# Altium schematic sheet 1-BLOCK DIAGRAM.SchDoc
size 420 x 297 mm; CompanyName: Microchip Technology Inc.; Organization: Microchip Technology; Address1: 2355 West Chandler Blvd.; Address2: Chandler, AZ  85224; Address4: USA; SheetTitle: **; Time: Time
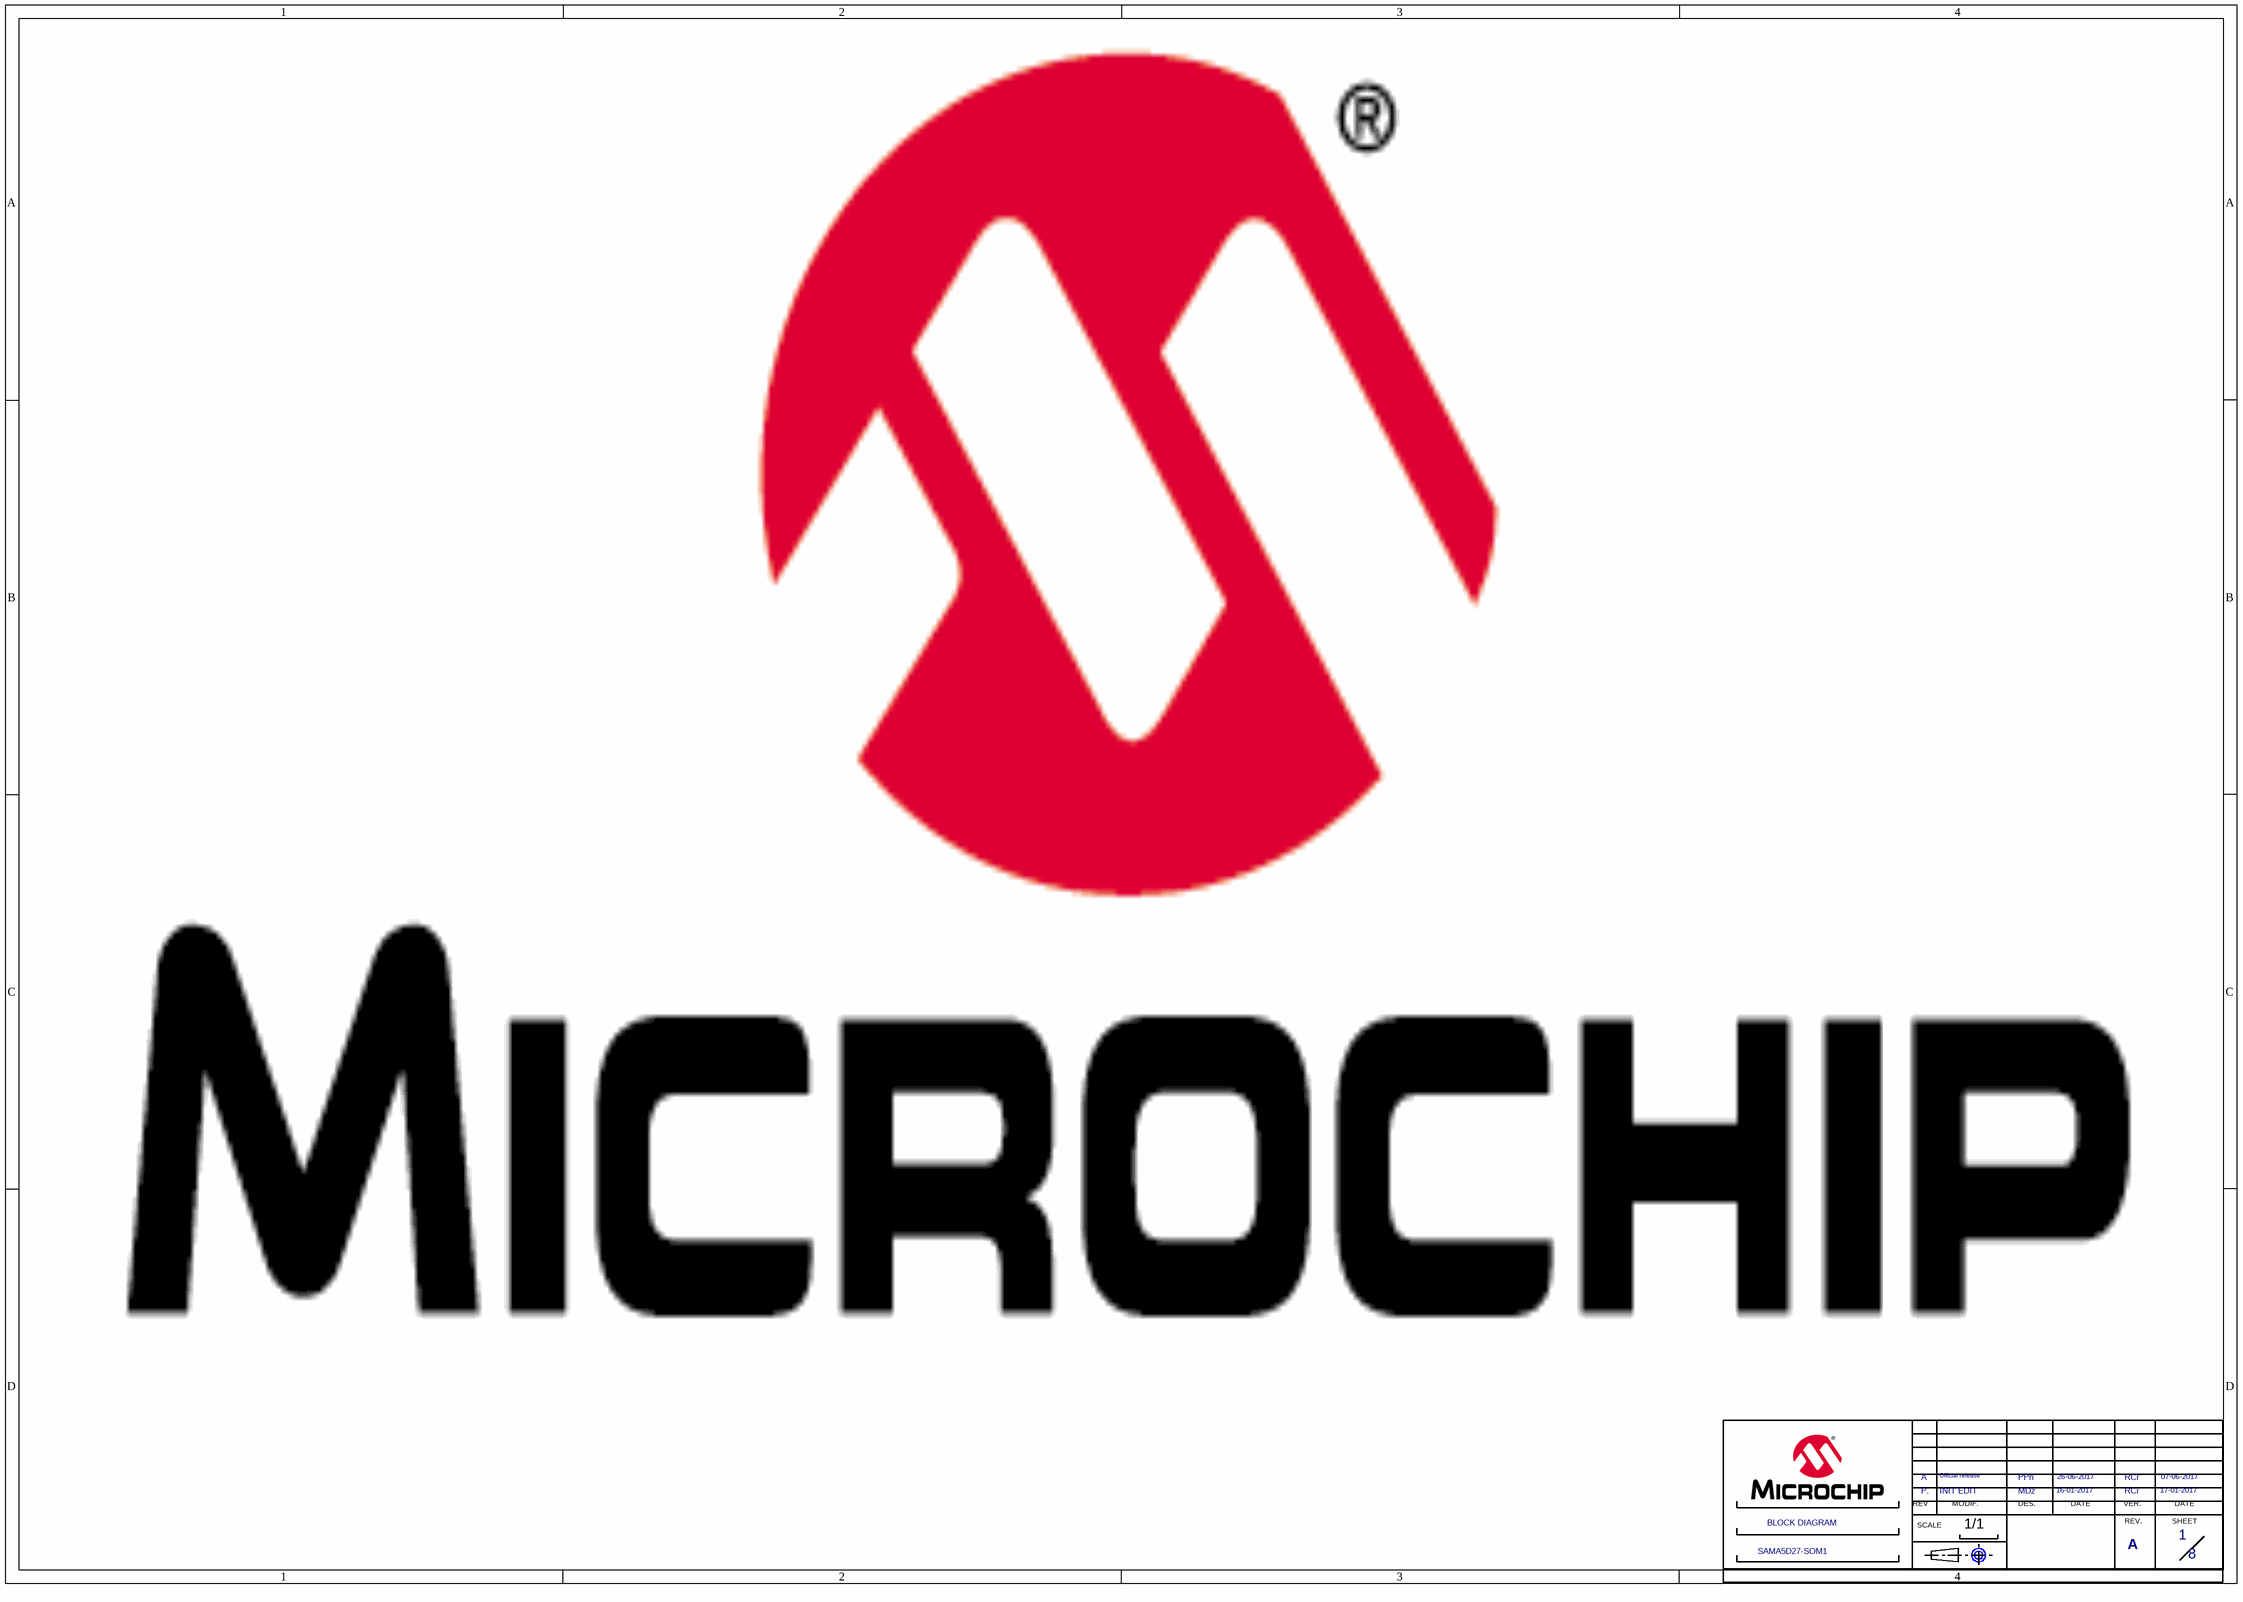
[diagram p0: 1-BLOCK DIAGRAM.SchDoc]

## Parts
*  MODIF.A: INIT EDIT  SHEET NAME 2: BLOCK DIAGRAM  SHEET NAME 1: SAMA5D27-SOM1  REV B: A  VERIF B: RCr  VERIF DATE A: 17-01-2017  VERIF DATE B: 07-06-2017  Page Count: 8  Page Number: 1  DATE A: 16-01-2017  DATE B: 26-06-2017  DES A: MDz  DES B: PPn  MODIF.B: Official release  REV A: P.  (hidden comment: CARTOUCHE MICROCHIP)  (graphical)
?  (no value)  (graphical)

## Notes on the sheet
- Drawn By:
- Engineer:
- PartNumber:
- Project Title
- Sheet Title
- Size
- B
- Revision:
- Sch #:
- Date:
- Sheet
- Designed with
- Altium.com <http://go.altium.com/MicrochipLandingPage_Evaluation.html>
- File:
- (in symbol CARTOUCHE MICROCHIP) REV; MODIF.; DES.; DATE; VER.; SCALE; REV.; SHEET; 1/1

## Library data of the parts
* = CARTOUCHE MICROCHIP: REV D: D; REV C: C; REV F: F; REV E: E; VERIF F: XXX; VERIF DATE F: XX-XXX-XX; MODIF.C: RevC; MODIF.D: RevD; MODIF.E: RevE; MODIF.F: RevF; VERIF E: XXX; VERIF D: XXX; VERIF C: RCr; VERIF A: RCr; VERIF DATE E: XX-XXX-XX; VERIF DATE D: XX-XXX-XX; VERIF DATE C: 07-06-2017; REV: A; FT: ?; Page Size: A; Page Create Date: june 19, 2004; DATE C: 07-06-2017; DATE D: XX-XXX-XX; DATE E: XX-XXX-XX; DATE F: XX-XXX-XX; DES E: XXX; DES F: XXX; DES C: XXX; DES D: XXX
? = Title Block B